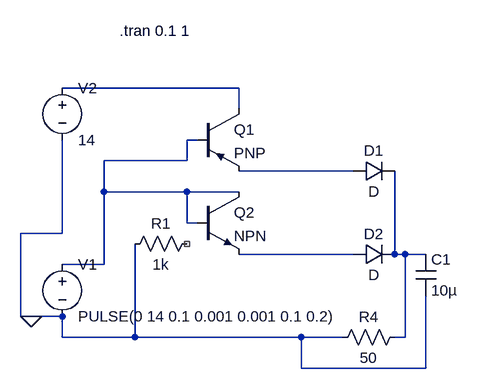
[diagram p0: schematic Draft22.asc]
Draft22.asc, the LTspice schematic file:
Version 4
SHEET 1 1028 680
WIRE 496 192 224 192
WIRE 496 224 496 192
WIRE 432 272 416 272
WIRE 416 304 416 272
WIRE 416 304 288 304
WIRE 672 320 496 320
WIRE 288 352 288 304
WIRE 416 352 288 352
WIRE 496 352 416 352
WIRE 416 400 416 352
WIRE 432 400 416 400
WIRE 224 416 224 272
WIRE 224 416 160 416
WIRE 672 448 496 448
WIRE 736 448 736 320
WIRE 752 448 736 448
WIRE 784 448 752 448
WIRE 288 464 288 352
WIRE 288 464 224 464
WIRE 160 544 160 416
WIRE 176 544 160 544
WIRE 224 544 176 544
WIRE 224 576 224 544
WIRE 336 576 336 432
WIRE 336 576 224 576
WIRE 592 576 336 576
WIRE 656 576 592 576
WIRE 752 576 752 448
WIRE 752 576 736 576
WIRE 592 624 592 576
WIRE 784 624 784 512
WIRE 784 624 592 624
FLAG 176 544 0
SYMBOL voltage 224 448 R0
SYMATTR InstName V1
SYMATTR Value PULSE(0 14 0.1 0.001 0.001 0.1 0.2)
SYMBOL voltage 224 176 R0
SYMATTR InstName V2
SYMATTR Value 14
SYMBOL res 432 416 R90
WINDOW 0 0 56 VBottom 2
WINDOW 3 32 56 VTop 2
SYMATTR InstName R1
SYMATTR Value 1k
SYMBOL diode 672 336 R270
WINDOW 0 32 32 VTop 2
WINDOW 3 0 32 VBottom 2
SYMATTR InstName D1
SYMBOL diode 672 464 R270
WINDOW 0 32 32 VTop 2
WINDOW 3 0 32 VBottom 2
SYMATTR InstName D2
SYMBOL res 752 560 R90
WINDOW 0 0 56 VBottom 2
WINDOW 3 32 56 VTop 2
SYMATTR InstName R4
SYMATTR Value 50
SYMBOL pnp 432 224 R0
SYMATTR InstName Q1
SYMBOL cap 768 448 R0
SYMATTR InstName C1
SYMATTR Value 10µ
SYMBOL npn 432 352 R0
SYMATTR InstName Q2
TEXT 312 104 Left 2 !.tran 0.1 1

The netlist it stands for:
* Draft22.asc
V1 N002 0 PULSE(0 14 0.1 0.001 0.001 0.1 0.2)
V2 N001 0 14
R1 NC_01 0 1k
D1 N003 N005 D
D2 N004 N005 D
R4 N005 0 50
Q1 N001 N002 N003 0 PNP
C1 N005 0 10µ
Q2 N002 N002 N004 0 NPN
.model D D
.lib standard.dio
.model NPN NPN
.model PNP PNP
.lib standard.bjt
.tran 0.1 1
.backanno
.end